# EAGLE design fanmon_old (EAGLE 6.6.0)
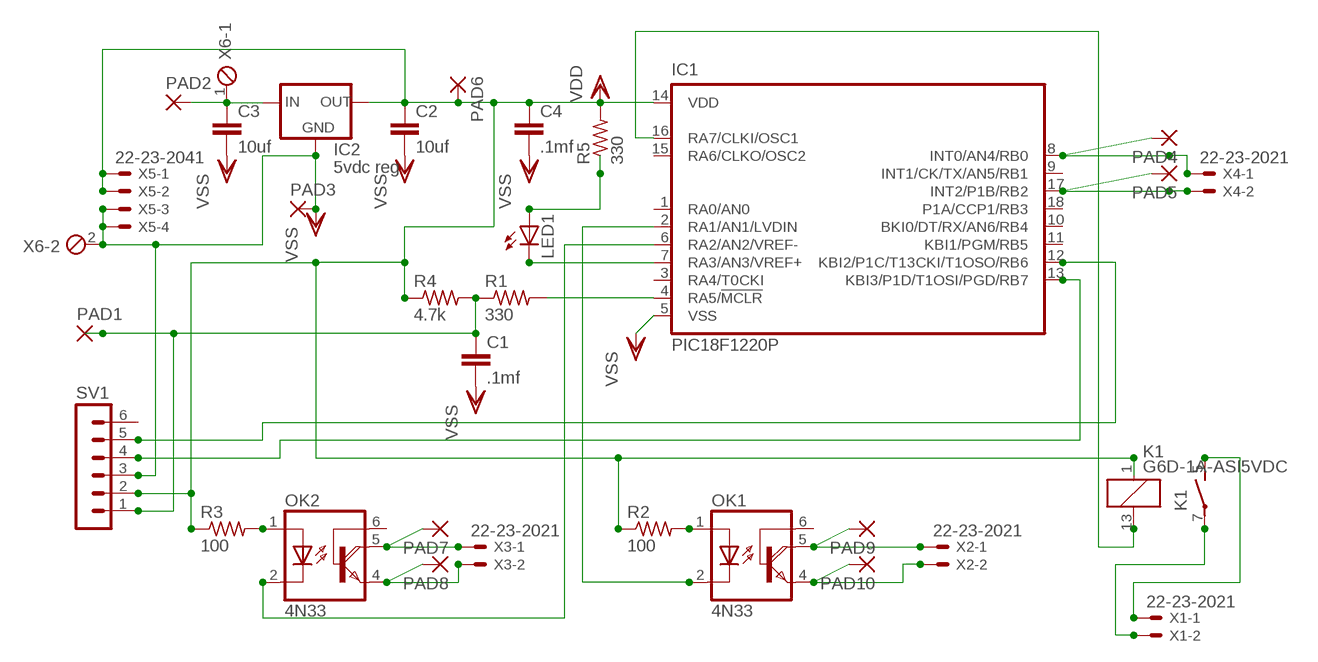
[diagram p0: schematic, sheet 1]

## Parts
C1  .1mf  C5/2.5  [C5B2.5]
C2  10uf  C5/2.5  [C5B2.5]
C3  10uf  C5/2.5  [C5B2.5]
C4  .1mf  C5/2.5  [C5B2.5]
IC1  PIC18F1220P  [DIL18]
IC2  5vdc reg  78XXL  [78XXL]
K1  G6D-1A-ASI5VDC  [G6D]
LED1  LED5MM  [LED5MM]
OK1  4N33  [DIL06]
OK2  4N33  [DIL06]
PAD1  1,6/0,8  [1,6/0,8]
PAD2  1,6/0,8  [1,6/0,8]
PAD3  1,6/0,8  [1,6/0,8]
PAD4  1,6/0,8  [1,6/0,8]
PAD5  1,6/0,8  [1,6/0,8]
PAD6  1,6/0,8  [1,6/0,8]
PAD7  1,6/0,8  [1,6/0,8]
PAD8  1,6/0,8  [1,6/0,8]
PAD9  1,6/0,8  [1,6/0,8]
PAD10  1,6/0,8  [1,6/0,8]
R1  330  R-US_0204/2V  [0204V]
R2  100  R-US_0204/2V  [0204V]
R3  100  R-US_0204/2V  [0204V]
R4  4.7k  R-US_0204/2V  [0204V]
R5  330  R-US_0204/2V  [0204V]
SV1  MA06-1  [MA06-1]
X1  22-23-2021  [22-23-2021]
X2  22-23-2021  [22-23-2021]
X3  22-23-2021  [22-23-2021]
X4  22-23-2021  [22-23-2021]
X5  22-23-2041  [22-23-2041]
X6  MPT2  [2POL254]

## Nets
N$1: IC1.4(RA5/!MCLR) R1.2
N$2: OK1.1(A) R2.2
N$3: OK2.1(A) R3.2
N$4: C1.1 PAD1.1(P) R1.1 R4.2 SV1.1
N$5: IC1.8(INT0/AN4/RB0) PAD4.1(P) X4.1
N$6: C3.1 IC2.IN PAD2.1(P) X6.1
N$7: IC1.17(INT2/P1B/RB2) PAD5.1(P) X4.2
N$8: IC1.2(RA1/AN1/LVDIN) OK1.2(C)
N$9: IC1.6(RA2/AN2/VREF-) OK2.2(C)
N$10: OK2.5(COL) PAD7.1(P) X3.1
N$11: OK2.4(E) PAD8.1(P) X3.2
N$12: OK1.5(COL) PAD9.1(P) X2.1
N$13: OK1.4(E) PAD10.1(P) X2.2
N$14: LED1.A R5.1
N$15: IC1.7(RA3/AN3/VREF+) LED1.K(C)
N$16: IC1.16(RA7/CLKI/OSC1) K1.13
N$17: K1.7(2:P) X1.2
N$18: K1.5(2:S) X1.1
N$20: IC1.13(KBI3/P1D/T1OSI/PGD/RB7) SV1.4
N$21: IC1.12(KBI2/P1C/T13CKI/T1OSO/RB6) SV1.5
VDD: C2.1 C4.1 IC1.14(VDD) IC2.OUT K1.1 PAD6.1(P) R2.1 R3.1 R4.1 R5.2 SV1.2 X5.1 X5.2
VSS: C1.2 C2.2 C3.2 C4.2 IC1.5(VSS) IC2.GND PAD3.1(P) SV1.3 X5.3 X5.4 X6.2
Unconnected: IC1.1(RA0/AN0) IC1.3(RA4/T0CKI) IC1.9(INT1/CK/TX/AN5/RB1) IC1.10(BKI0/DT/RX/AN6/RB4) IC1.11(KBI1/PGM/RB5) IC1.15(RA6/CLKO/OSC2) IC1.18(P1A/CCP1/RB3) OK1.6(B) OK2.6(B) SV1.6

## Library data of the parts
C1-C4 = capacitor-wima:C: CAPACITOR naming: grid - package width
IC1 = microchip:PIC18F1*20: 18/20/28-Pin High-Performance, Enhanced Flash Microcontrollers with 10-bit A/D and nanoWatt Technology Source: ww1.microchip.com/downloads/en/DeviceDoc/39605c.pdf; MF: MICROCHIP; MPN: PIC18F1220-I/P; OC_FARNELL: 9761977; OC_NEWARK: 92C2429
IC2 = v-reg:78XXL: VOLTAGE REGULATOR
K1 = relay:G6D?*: OMRON Slim, Miniature PCB Relay 17.5 × 6.5 × 12.5 mm with Socked Source: http://ecb.omron.com.sg/pdf/relay/power/G6D.pdf; OC_FARNELL: 9812660; OC_NEWARK: unknown
LED1 = led:LED: LED OSRAM: - CHIPLED LG R971, LG N971, LY N971, LG Q971, LY Q971, LO R971, LY R971 LH N974, LH R974 LS Q976, LO Q976, LY Q976 LO Q996 - Hyper CHIPLED LW Q18S LB Q993, LB Q99A, LB R99A - SideLED LS A670, LO A670, LY A670, LG A670, LP A670 LB A673, LV A673, LT A673, LW A673 LH A674 LY A675 LS A676, LA A676, LO A676, LY A676, LW A676 LS A679, LY A679, LG A679 - Hyper Micro SIDELED® LS Y876, LA Y876, LO Y876, LY Y876 LT Y87S - SmartLED LW L88C, LW L88S LB L89C, LB L89S, LG L890 LS L89K, LO L89K, LY L89K LS L896, LA L896, LO L896, LY L896 - TOPLED LS T670, LO T670, LY T670, LG T670, LP T670 LSG T670, LSP T670, LSY T670, LOP T670, LYG T670 LG T671, LOG T671, LSG T671 LB T673, LV T673, LT T673, LW T673 LH T674 LS T676, LA T676, LO T676, LY T676, LB T676, LH T676, LSB T676, LW T676 LB T67C, LV T67C, LT T67C, LS T67K, LO T67K, LY T67K, LW E67C LS E67B, LA E67B, LO E67B, LY E67B, LB E67C, LV E67C, LT E67C LW T67C LS T679, LY T679, LG T679 LS T770, LO T770, LY T770, LG T770, LP T770 LB T773, LV T773, LT T773, LW T773 LH T774 LS E675, LA E675, LY E675, LS T675 LS T776, LA T776, LO T776, LY T776, LB T776 LHGB T686 LT T68C, LB T68C - Hyper Mini TOPLED® LB M676 - Mini TOPLED Santana® LG M470 LS M47K, LO M47K, LY M47K Source: http://www.osram.convergy.de LUXEON: - LUMILED® LXK2-PW12-R00, LXK2-PW12-S00, LXK2-PW14-U00, LXK2-PW14-V00 LXK2-PM12-R00, LXK2-PM12-S00, LXK2-PM14-U00 LXK2-PE12-Q00, LXK2-PE12-R00, LXK2-PE12-S00, LXK2-PE14-T00, LXK2-PE14-U00 LXK2-PB12-K00, LXK2-PB12-L00, LXK2-PB12-M00, LXK2-PB14-N00, LXK2-PB14-P00, LXK2-PB14-Q00 LXK2-PR12-L00, LXK2-PR12-M00, LXK2-PR14-Q00, LXK2-PR14-R00 LXK2-PD12-Q00, LXK2-PD12-R00, LXK2-PD12-S00 LXK2-PH12-R00, LXK2-PH12-S00 LXK2-PL12-P00, LXK2-PL12-Q00, LXK2-PL12-R00 Source: www.luxeon.com KINGBRIGHT: KA-3528ASYC Source: www.kingbright.com
OK1 OK2 = optocoupler:4N33: MOTOROLA OPTO COUPLER; MF: VISHAY/TELEFUNKEN; MPN: 4N33; OC_FARNELL: 1469601; OC_NEWARK: 88K1390
PAD1-PAD10 = wirepad:1,6/0,8: THROUGH-HOLE PAD
R1-R5 = resistor:R-US_: RESISTOR, American symbol
SV1 = con-lstb:MA06-1: PIN HEADER; OC_FARNELL: unknown; OC_NEWARK: unknown
X1-X4 = con-molex:22-23-2021: .100" (2.54mm) Center Header - 2 Pin; MF: MOLEX; MPN: 22-23-2021; OC_FARNELL: 1462926; OC_NEWARK: 25C3832
X5 = con-molex:22-23-2041: .100" (2.54mm) Center Header - 4 Pin; MF: MOLEX; MPN: 22-23-2041; OC_FARNELL: 1462920; OC_NEWARK: 38C0355
X6 = con-phoenix-254:MPT2: PHOENIX CONNECTOR; OC_FARNELL: unknown; OC_NEWARK: unknown

## Board
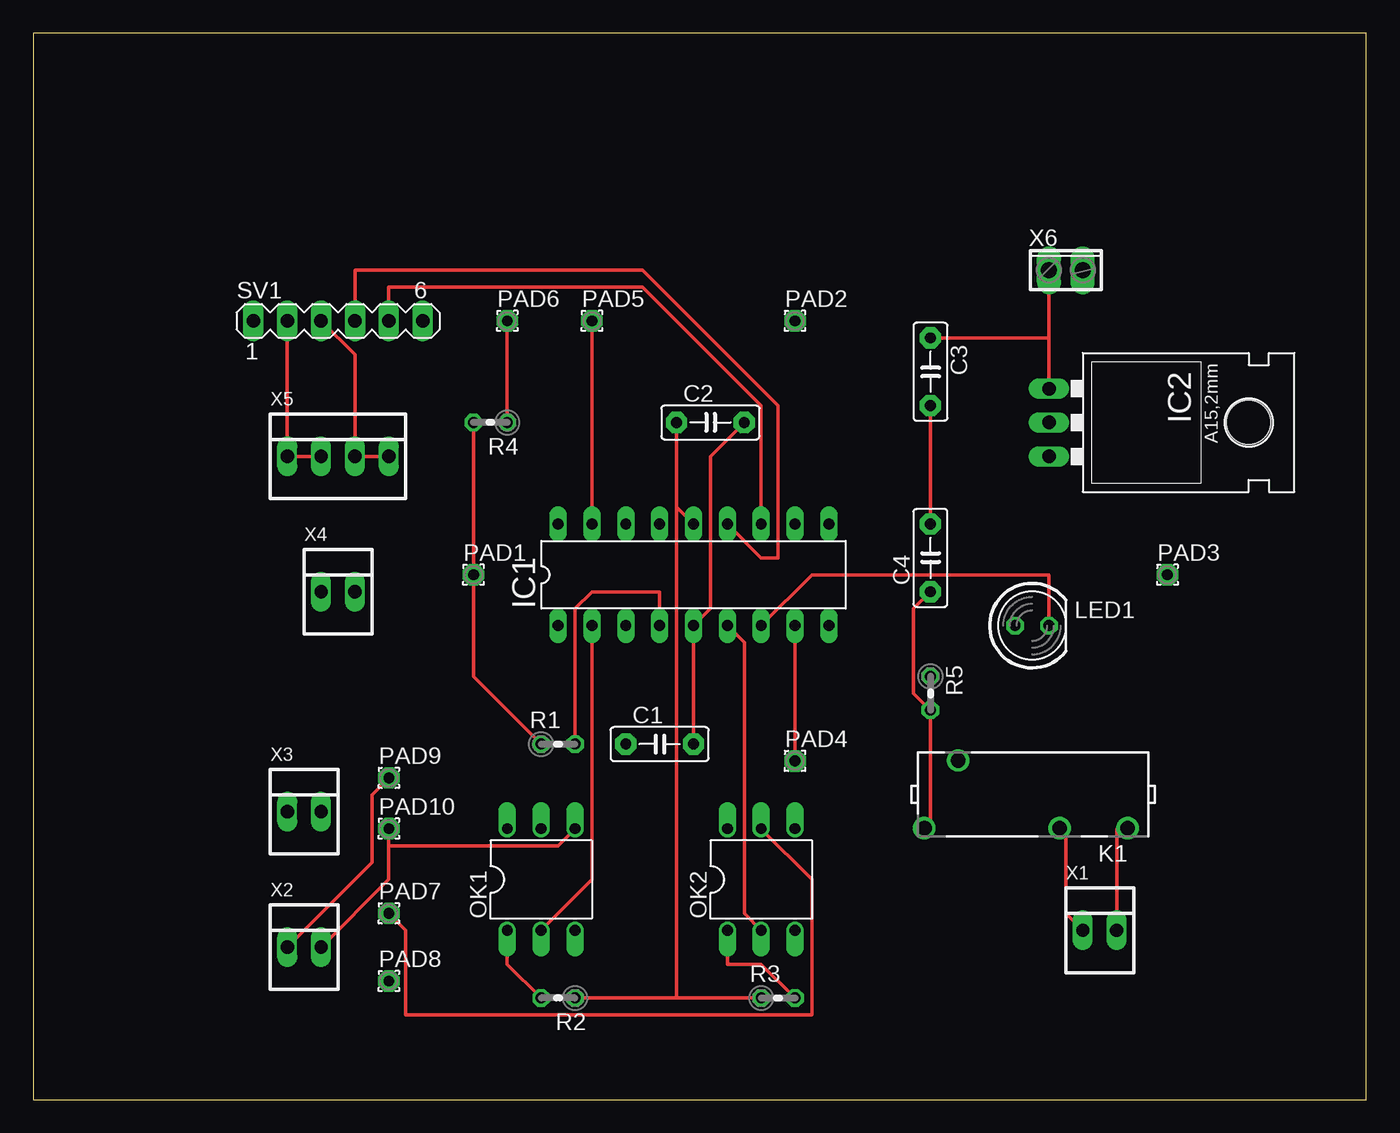
[diagram p1: board, top side]
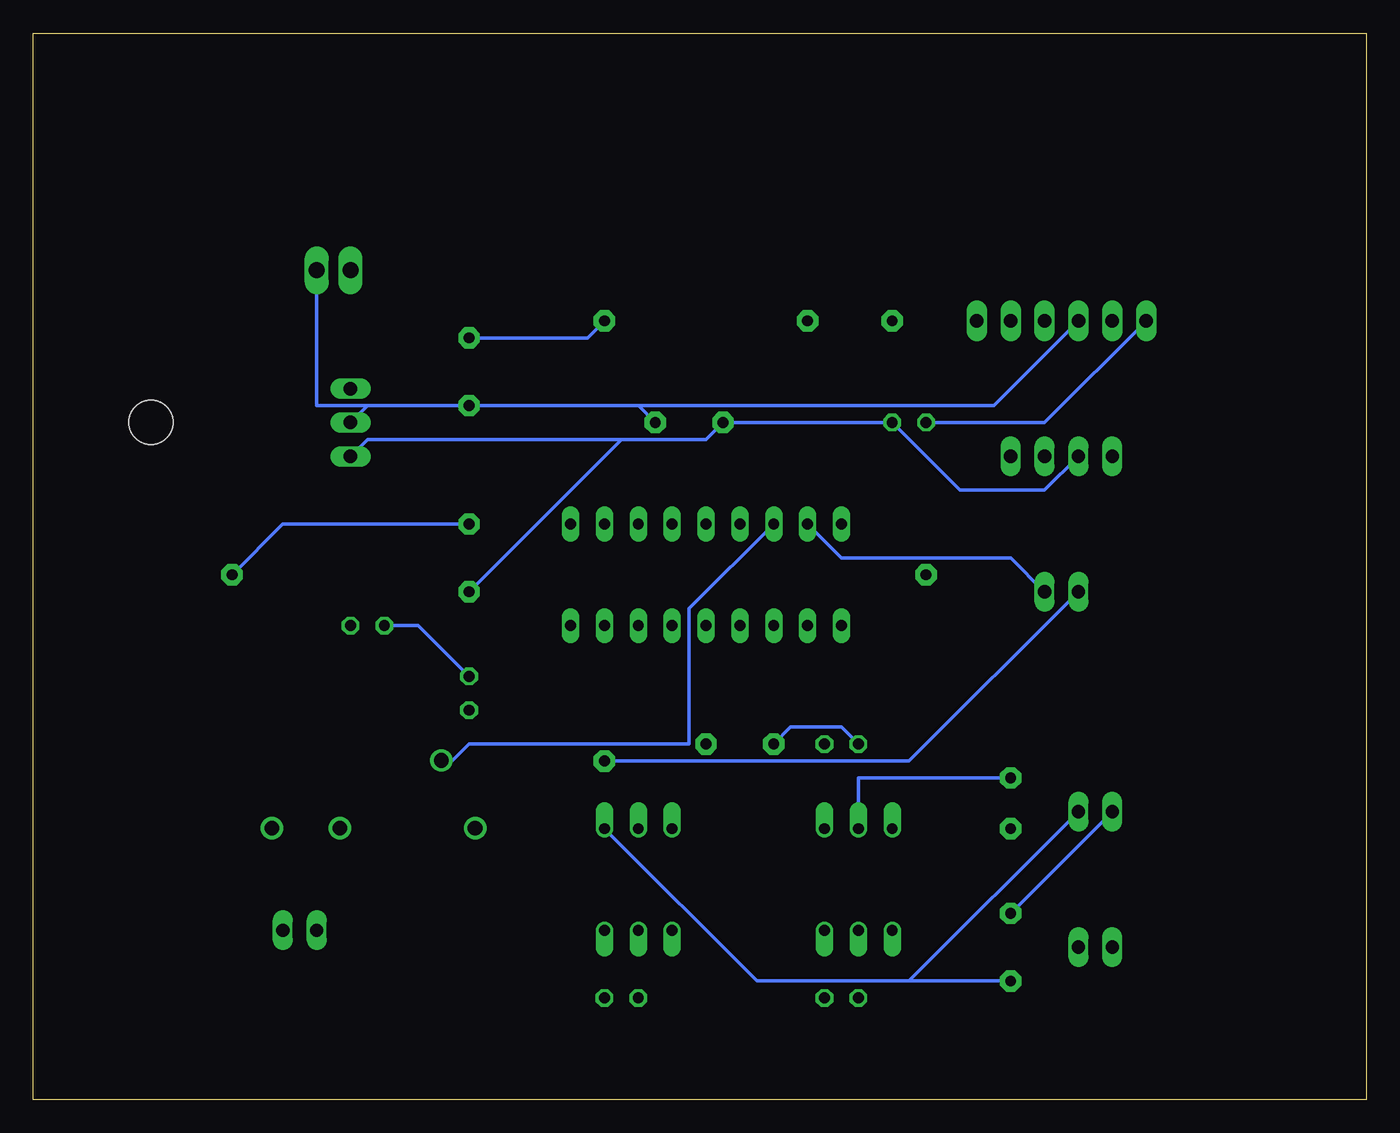
[diagram p2: board, bottom side, seen from below]

Size 100 x 80 mm. Coordinates in mm from the lower left corner, seen from the top.
Outline: 0,0 100,0 100,80 0,80 0,0
Copper layers (1*16): Top 0.035mm / dielectric 1.5mm / Bottom 0.035mm
Design rules "default": minimum track width 10mil, minimum drill 24mil, track to track 8mil, track to pad 8mil, pad to pad 8mil, via to via 8mil, smd to smd 8mil, copper to edge 40mil, drill to drill 8mil, minimum pad ring 10mil, minimum via ring 8mil, stop-mask expansion 4mil, vias tented up to drill 0mil, thermal gap 10mil

### Footprints (pad centres in the part's own frame; a part is rotated, then mirrored left to right if it is on the bottom)
C5B2.5 = drill 0.813 pad 1.6 octagon: 1 -2.54,0; 2 2.54,0
DIL18 = drill 0.813 long: 1 -10.16,-3.81; 2 -7.62,-3.81; 3 -5.08,-3.81; 4 -2.54,-3.81; 5 0,-3.81; 6 2.54,-3.81; 7 5.08,-3.81; 8 7.62,-3.81; 9 10.16,-3.81; 10 10.16,3.81; 11 7.62,3.81; 12 5.08,3.81; 13 2.54,3.81; 14 0,3.81; 15 -2.54,3.81; 16 -5.08,3.81; 17 -7.62,3.81; 18 -10.16,3.81
78XXL = drill 1.016 long: GND 0,-3.81; IN -2.54,-3.81; OUT 2.54,-3.81 | hole 3.302: 0,11.176
G6D = drill 1.1 pad 1.676: 1 8.08,2.5; 5 -2.08,2.5; 7 -7.16,2.5; 13 5.54,-2.58
LED5MM = drill 0.813 octagon: A -1.27,0; K 1.27,0
DIL06 = drill 0.813 offset: 1 -2.54,-3.81; 2 0,-3.81; 3 2.54,-3.81; 4 2.54,3.81; 5 0,3.81; 6 -2.54,3.81
1,6/0,8 = drill 0.813 pad 1.6 octagon: 1 0,0
0204V = drill 0.813 octagon: 1 -1.27,0; 2 1.27,0
MA06-1 = drill 1.016 long: 1 -6.35,0; 2 -3.81,0; 3 -1.27,0; 4 1.27,0; 5 3.81,0; 6 6.35,0
22-23-2021 = drill 1 long: 1 -1.27,0; 2 1.27,0
22-23-2041 = drill 1 long: 1 -3.81,0; 2 -1.27,0; 3 1.27,0; 4 3.81,0
2POL254 = drill 1.2 long: 1 -1.27,0; 2 1.27,0

### Placement (x,y rotation side)
C1  46.99,26.67 0 top
C2  50.8,50.8 0 top
C3  67.31,54.61 270 top
C4  67.31,40.64 90 top
DRILEGEND  [DRILEGEND]  0,-3.81 0 top  (outside the outline)
IC1  49.53,39.37 0 top
IC2  80.01,50.8 270 top
K1  74.93,22.86 180 top
LED1  74.93,35.56 0 top
OK1  38.1,16.51 0 top
OK2  54.61,16.51 0 top
PAD1  33.02,39.37 0 top
PAD2  57.15,58.42 0 top
PAD3  85.09,39.37 0 top
PAD4  57.15,25.4 0 top
PAD5  41.91,58.42 0 top
PAD6  35.56,58.42 0 top
PAD7  26.67,13.97 0 top
PAD8  26.67,8.89 0 top
PAD9  26.67,24.13 0 top
PAD10  26.67,20.32 0 top
R1  39.37,26.67 0 top
R2  39.37,7.62 180 top
R3  55.88,7.62 0 top
R4  34.29,50.8 180 top
R5  67.31,30.48 270 top
SV1  22.86,58.42 0 top
X1  80.01,12.7 0 top
X2  20.32,11.43 0 top
X3  20.32,21.59 0 top
X4  22.86,38.1 0 top
X5  22.86,48.26 0 top
X6  77.47,62.23 0 top

### Tracks (layer width: path | path; a pad name or v marks a point on that pad's centre or on a via)
N$1
  Top 0.254: R1.2 40.64,36.83 41.91,38.1 46.99,38.1 IC1.4
N$2
  Top 0.254: R2.2 35.56,10.16 OK1.1
N$3
  Top 0.254: R3.2 54.61,10.16 52.07,10.16 OK2.1
N$4
  Top 0.254: R4.2 PAD1.1 33.02,31.75 R1.1
  Bottom 0.254: SV1.1 24.13,50.8 R4.2 | C1.1 43.18,27.94 39.37,27.94 R1.1
N$5
  Top 0.254: PAD4.1 IC1.8
  Bottom 0.254: X4.1 34.29,25.4 PAD4.1
N$6
  Top 0.254: X6.1 76.2,57.15 | 76.2,57.15 IC2.IN | C3.1 76.2,57.15
  Bottom 0.254: PAD2.1 58.42,57.15 C3.1
N$7
  Top 0.254: PAD5.1 IC1.17
  Bottom 0.254: X4.2 26.67,40.64 39.37,40.64 IC1.17
N$8
  Top 0.254: OK1.2 41.91,16.51 IC1.2
N$9
  Top 0.254: OK2.2 53.34,13.97 53.34,34.29 IC1.6
N$10
  Top 0.254: OK2.5 58.42,16.51 58.42,6.35 27.94,6.35 27.94,12.7 PAD7.1
  Bottom 0.254: PAD7.1 X3.1
N$11
  Bottom 0.254: OK2.4 45.72,8.89 34.29,8.89 | PAD8.1 34.29,8.89 | 34.29,8.89 X3.2
N$12
  Top 0.254: X2.1 25.4,17.78 25.4,22.86 PAD9.1
  Bottom 0.254: OK1.5 38.1,24.13 PAD9.1
N$13
  Top 0.254: OK1.4 39.37,19.05 26.67,19.05 | PAD10.1 26.67,19.05 | X2.2 26.67,16.51 26.67,19.05
N$14
  Bottom 0.254: R5.1 71.12,35.56 LED1.A
N$15
  Top 0.254: IC1.7 58.42,39.37 76.2,39.37 LED1.K
N$16
  Bottom 0.254: IC1.16 50.8,36.83 50.8,26.67 67.31,26.67 68.58,25.4 K1.13
N$17
  Top 0.254: X1.2 81.28,20.32 K1.7
N$18
  Top 0.254: X1.1 77.47,13.97 77.47,20.32 K1.5
N$20
  Top 0.254: IC1.13 54.61,40.64 55.88,40.64 55.88,52.07 45.72,62.23 24.13,62.23 SV1.4
N$21
  Top 0.254: IC1.12 54.61,52.07 45.72,60.96 26.67,60.96 SV1.5
VDD
  Top 0.254: R3.1 48.26,7.62 | 48.26,7.62 R2.1 | X5.2 X5.1 SV1.2 | K1.1 67.31,20.32 R5.2 66.04,30.48 66.04,36.83 C4.1 | PAD6.1 R4.1 | 48.26,44.45 IC1.14 | C2.1 48.26,44.45 | 48.26,44.45 48.26,7.62
  Bottom 0.254: IC2.OUT 74.93,49.53 55.88,49.53 | 55.88,49.53 49.53,49.53 C2.1 R4.1 30.48,45.72 24.13,45.72 X5.2 | 55.88,49.53 C4.1
VSS
  Top 0.254: X5.4 X5.3 24.13,55.88 SV1.3 | C1.2 IC1.5 50.8,36.83 50.8,48.26 C2.2 | C3.2 C4.2
  Bottom 0.254: 74.93,52.07 IC2.GND | 74.93,52.07 C3.2 54.61,52.07 | 54.61,52.07 C2.2 | PAD3.1 81.28,43.18 C4.2 | X6.2 78.74,52.07 74.93,52.07 | SV1.3 27.94,52.07 54.61,52.07

### Text on the board
DrillLegend: LAYER-STACK
DrillLegend_01-16: 01-16
DrillLegend_01-20: 01-20